# Altium schematic sheet Protoboard.SchDoc
size A; Organization: Machine Intelligence Laboratory; Address1: 571 Gale Lemerand Dr.; Address2: Suite #126; Address3: Gainesville, FL, 32611; SheetNumber: 1; SheetTotal: 1
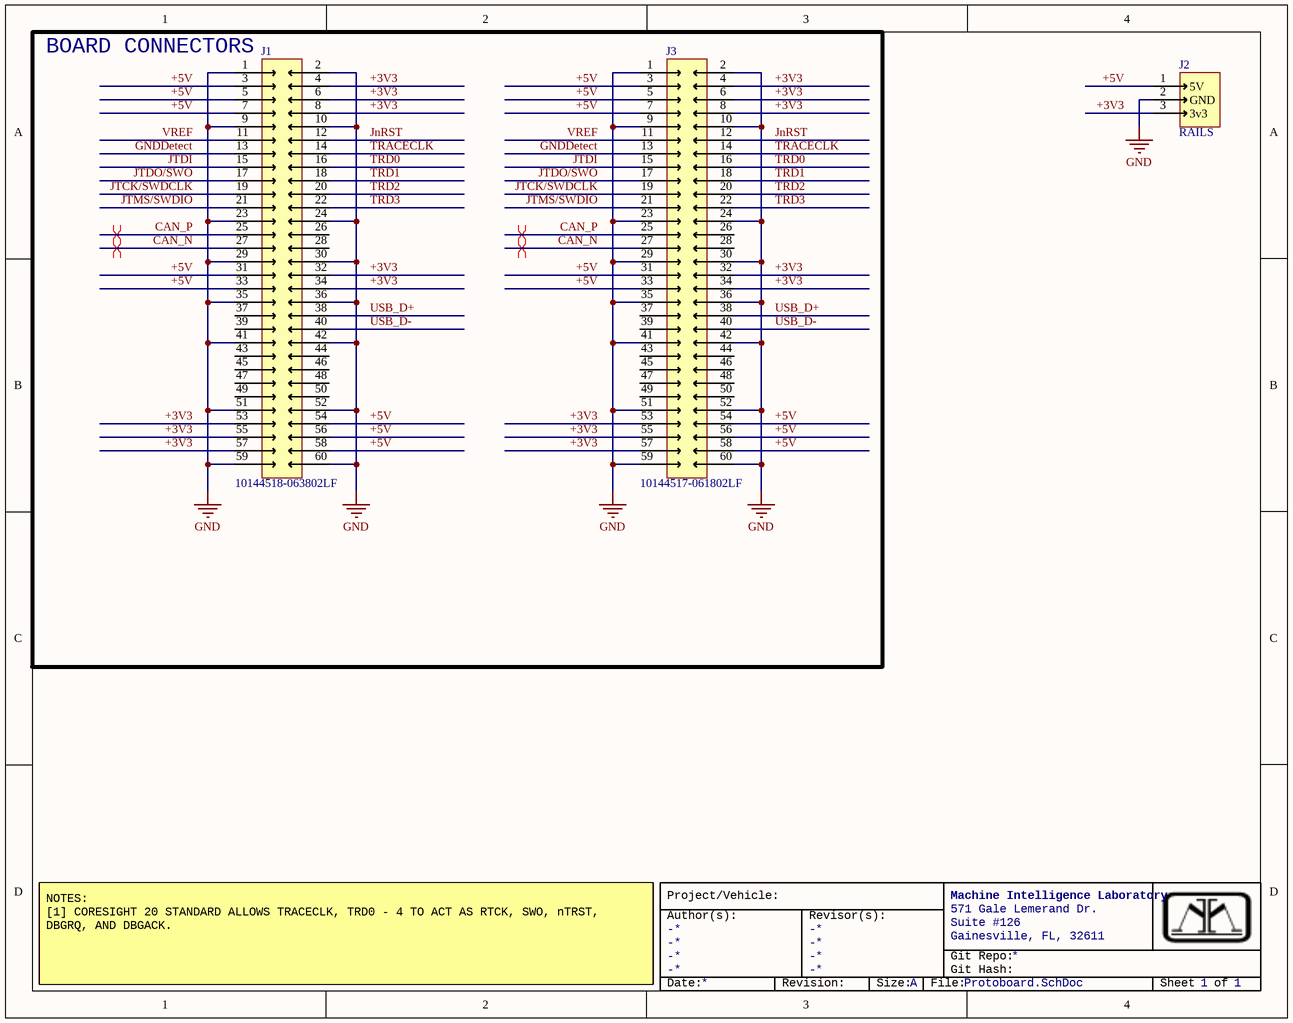
[diagram p0: Protoboard.SchDoc]

## Parts
J1  10144518-063802LF  [AMPHENOL_10144518-063802LF]
J2  RAILS  [75x95VIAS]  (no BOM)
J3  10144517-061802LF  [AMPHENOL_10144517-061802LF]

## Blocks framed on the sheet
BOARD CONNECTORS: J1 J3

## Nets
GND: J1.1 J1.2 J1.9 J1.10 J1.23 J1.24 J1.29 J1.30 J1.35 J1.36 J1.41 J1.42 J1.51 J1.52 J1.59 J1.60 J2.2(GND) J3.1 J3.2 J3.9 J3.10 J3.23 J3.24 J3.29 J3.30 J3.35 J3.36 J3.41 J3.42 J3.51 J3.52 J3.59 J3.60
+3V3: J1.4 J1.6 J1.8 J1.32 J1.34 J1.53 J1.55 J1.57 J2.3(3v3) J3.4 J3.6 J3.8 J3.32 J3.34 J3.53 J3.55 J3.57
+5V: J1.3 J1.5 J1.7 J1.31 J1.33 J1.54 J1.56 J1.58 J2.1(5V) J3.3 J3.5 J3.7 J3.31 J3.33 J3.54 J3.56 J3.58
CAN_N: J1.27 J3.27
CAN_P: J1.25 J3.25
GNDDetect: J1.13 J3.13
JnRST: J1.12 J3.12
JTCK/SWDCLK: J1.19 J3.19
JTDI: J1.15 J3.15
JTDO/SWO: J1.17 J3.17
JTMS/SWDIO: J1.21 J3.21
TRACECLK: J1.14 J3.14
TRD0: J1.16 J3.16
TRD1: J1.18 J3.18
TRD2: J1.20 J3.20
TRD3: J1.22 J3.22
USB_D+: J1.38 J3.38
USB_D-: J1.40 J3.40
VREF: J1.11 J3.11

Not connected (* = marked no-connect by the designer): J1 26 28 37 39 43 44 45 46 47 48 49 50; J3 26 28 37 39 43 44 45 46 47 48 49 50

## Layout directives
differential pair; rule Matched Net Lengths [Tolerance = 5mil]; rule Differential Pairs Routing [Pref Gap = 10mil    Min Gap  = 10mil    Max Gap  = 10milPref Width = 15mil    Min Width  = 15mil    Max Width  = 15mil]; net class CAN; differential pair class CAN_LINES: CAN_N, CAN_P

## Notes on the sheet
- NOTES:
  [1] CORESIGHT 20 STANDARD ALLOWS TRACECLK, TRD0 - 4 TO ACT AS RTCK, SWO, nTRST, DBGRQ, AND DBGACK.
- Project/Vehicle:
- PLACE NOTES BOX HERE
- Author(s):
- -
- Revisor(s):
- Git Repo:
- Git Hash:
- Date:
- Revision:
- Size:
- A
- File:
- Sheet
- of

## Library data of the parts
J1 = 10144518-063802LF: CONN PLUG 60POS SMD GOLD; System: Connector; Supplier 1: Digi-Key; Supplier Part Number 1: 609-5451-1-ND
J2 = PROTORAIL1
J3 = 10144517-061802LF: CONN RCPT 60POS SMD GOLD; System: Connector; Supplier 1: Digi-Key; Supplier Part Number 1: 609-5433-1-ND